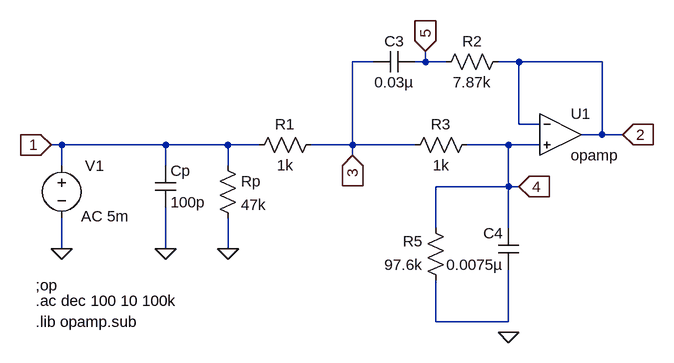
[diagram p0: schematic Op Amp Lipshitz_c Preamp V3.asc]
Op Amp Lipshitz_c Preamp V3.asc, the LTspice schematic file:
Version 4
SHEET 1 1876 1124
WIRE 208 48 176 48
WIRE 288 48 288 32
WIRE 288 48 272 48
WIRE 320 48 288 48
WIRE 432 48 400 48
WIRE 560 48 432 48
WIRE 432 144 432 48
WIRE 464 144 432 144
WIRE 560 160 560 48
WIRE 560 160 528 160
WIRE 592 160 560 160
WIRE -272 176 -288 176
WIRE -112 176 -272 176
WIRE -16 176 -112 176
WIRE 32 176 -16 176
WIRE 176 176 176 48
WIRE 176 176 112 176
WIRE 272 176 176 176
WIRE 416 176 352 176
WIRE 464 176 416 176
WIRE 176 192 176 176
WIRE -272 208 -272 176
WIRE -112 208 -112 176
WIRE -16 208 -16 176
WIRE 416 240 416 176
WIRE 416 240 304 240
WIRE 432 240 416 240
WIRE 304 304 304 240
WIRE 416 304 416 240
WIRE -272 336 -272 288
WIRE -112 336 -112 272
WIRE -16 336 -16 288
WIRE 304 448 304 384
WIRE 416 448 416 368
WIRE 416 448 304 448
FLAG -272 336 0
FLAG -288 176 1
IOPIN -288 176 In
FLAG -112 336 0
FLAG -16 336 0
FLAG 592 160 2
IOPIN 592 160 In
FLAG 288 32 5
IOPIN 288 32 In
FLAG 416 464 0
FLAG 176 192 3
IOPIN 176 192 In
FLAG 432 240 4
IOPIN 432 240 In
SYMBOL voltage -272 192 R0
WINDOW 3 24 44 Left 2
WINDOW 123 30 94 Left 2
WINDOW 0 36 16 Left 2
WINDOW 39 0 0 Left 2
SYMATTR Value ""
SYMATTR Value2 AC 5m
SYMATTR InstName V1
SYMBOL cap -128 208 R0
SYMATTR InstName Cp
SYMATTR Value 100p
SYMBOL res -32 192 R0
SYMATTR InstName Rp
SYMATTR Value 47k
SYMBOL OpAmps\\opamp 496 96 R0
SYMATTR InstName U1
SYMBOL cap 272 32 R90
WINDOW 0 0 32 VBottom 2
WINDOW 3 32 32 VTop 2
SYMATTR InstName C3
SYMATTR Value 0.03µ
SYMBOL res 416 32 R90
WINDOW 0 0 56 VBottom 2
WINDOW 3 32 56 VTop 2
SYMATTR InstName R2
SYMATTR Value 7.87k
SYMBOL res 320 400 R180
WINDOW 0 36 76 Left 2
WINDOW 3 36 40 Left 2
SYMATTR InstName R5
SYMATTR Value 97.6k
SYMBOL cap 432 368 R180
WINDOW 0 24 56 Left 2
WINDOW 3 24 8 Left 2
SYMATTR InstName C4
SYMATTR Value 0.0075µ
SYMBOL res 128 160 R90
WINDOW 0 0 56 VBottom 2
WINDOW 3 32 56 VTop 2
SYMATTR InstName R1
SYMATTR Value 1k
SYMBOL res 368 160 R90
WINDOW 0 0 56 VBottom 2
WINDOW 3 32 56 VTop 2
SYMATTR InstName R3
SYMATTR Value 1k
TEXT -312 392 Left 2 !;op
TEXT -312 416 Left 2 !.ac dec 100 10 100k
TEXT -312 448 Left 2 !.lib opamp.sub

The netlist it stands for:
* Op Amp Lipshitz_c Preamp V3.asc
V1 1 0 AC 5m
Cp 1 0 100p
Rp 1 0 47k
XU1 2 4 2 opamp Aol=100K GBW=10Meg  ; pins invin noninvin out
C3 5 3 0.03µ
R2 2 5 7.87k
R5 N001 4 97.6k
C4 N001 4 0.0075µ
R1 3 1 1k
R3 4 3 1k
;op
.ac dec 100 10 100k
.lib opamp.sub
.backanno
.end